# Altium schematic sheet LCD.SchDoc: LCD
size A4
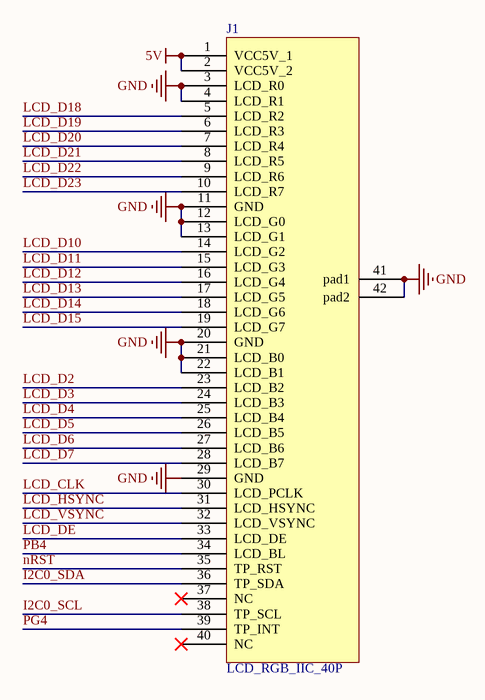
[diagram p0: LCD.SchDoc]

## Parts
J1  LCD_RGB_IIC_40P  [FPC_40P]

## Nets
5V: J1.1(VCC5V_1) J1.2(VCC5V_2)
GND: J1.3(LCD_R0) J1.4(LCD_R1) J1.11(GND) J1.12(LCD_G0) J1.13(LCD_G1) J1.20(GND) J1.21(LCD_B0) J1.22(LCD_B1) J1.29(GND) J1.41(pad1) J1.42(pad2)
I2C0_SCL: J1.38(TP_SCL)
I2C0_SDA: J1.36(TP_SDA)
LCD_CLK: J1.30(LCD_PCLK)
LCD_D2: J1.23(LCD_B2)
LCD_D3: J1.24(LCD_B3)
LCD_D4: J1.25(LCD_B4)
LCD_D5: J1.26(LCD_B5)
LCD_D6: J1.27(LCD_B6)
LCD_D7: J1.28(LCD_B7)
LCD_D10: J1.14(LCD_G2)
LCD_D11: J1.15(LCD_G3)
LCD_D12: J1.16(LCD_G4)
LCD_D13: J1.17(LCD_G5)
LCD_D14: J1.18(LCD_G6)
LCD_D15: J1.19(LCD_G7)
LCD_D18: J1.5(LCD_R2)
LCD_D19: J1.6(LCD_R3)
LCD_D20: J1.7(LCD_R4)
LCD_D21: J1.8(LCD_R5)
LCD_D22: J1.9(LCD_R6)
LCD_D23: J1.10(LCD_R7)
LCD_DE: J1.33(LCD_DE)
LCD_HSYNC: J1.31(LCD_HSYNC)
LCD_VSYNC: J1.32(LCD_VSYNC)
nRST: J1.35(TP_RST)
PB4: J1.34(LCD_BL)
PG4: J1.39(TP_INT)

Not connected (* = marked no-connect by the designer): J1 37(NC)* 40(NC)*

## Notes on the sheet
- Title
- Size:
- Date:
- A4
- Number:
- Time:
- Revision:
- Sheet
- of
- File:

## Library data of the parts
J1 = LCD_RGB_IIC_40P: 自制LCD接口,RGB+IIC触摸，40P